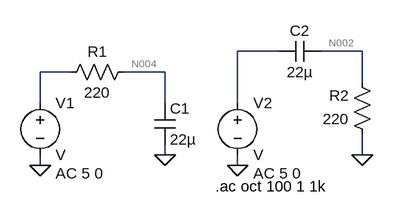
[diagram p0: schematic Draft2.asc]
Draft2.asc, the LTspice schematic file:
Version 4
SHEET 1 880 680
WIRE 336 96 272 96
WIRE 464 96 400 96
WIRE 16 128 -32 128
WIRE 160 128 96 128
WIRE 464 144 464 96
WIRE -32 176 -32 128
WIRE 160 176 160 128
WIRE 272 176 272 96
WIRE 160 256 160 240
WIRE 464 256 464 224
WIRE -32 272 -32 256
WIRE 272 272 272 256
FLAG 160 256 0
FLAG -32 272 0
FLAG 464 256 0
FLAG 272 272 0
SYMBOL res 112 112 R90
WINDOW 0 0 56 VBottom 2
WINDOW 3 32 56 VTop 2
SYMATTR InstName R1
SYMATTR Value 220
SYMBOL cap 144 176 R0
SYMATTR InstName C1
SYMATTR Value 22µ
SYMBOL voltage -32 160 R0
WINDOW 123 24 124 Left 2
WINDOW 39 0 0 Left 2
SYMATTR InstName V1
SYMATTR Value2 AC 5 0
SYMATTR SpiceLine ""
SYMBOL res 480 240 R180
WINDOW 0 36 76 Left 2
WINDOW 3 36 40 Left 2
SYMATTR InstName R2
SYMATTR Value 220
SYMBOL cap 336 112 R270
WINDOW 0 32 32 VTop 2
WINDOW 3 0 32 VBottom 2
SYMATTR InstName C2
SYMATTR Value 22µ
SYMBOL voltage 272 160 R0
WINDOW 123 24 124 Left 2
WINDOW 39 0 0 Left 2
SYMATTR InstName V2
SYMATTR Value2 AC 5 0
SYMATTR SpiceLine ""
TEXT 238 304 Left 2 !.ac oct 100 1 1k

The netlist it stands for:
* Draft2.asc
R1 N004 N003 220
C1 N004 0 22µ
V1 N003 0 V AC 5 0
R2 0 N002 220
C2 N001 N002 22µ
V2 N001 0 V AC 5 0
.ac oct 100 1 1k
.backanno
.end

* Results of the author's LTspice run, read from the files saved beside the schematic
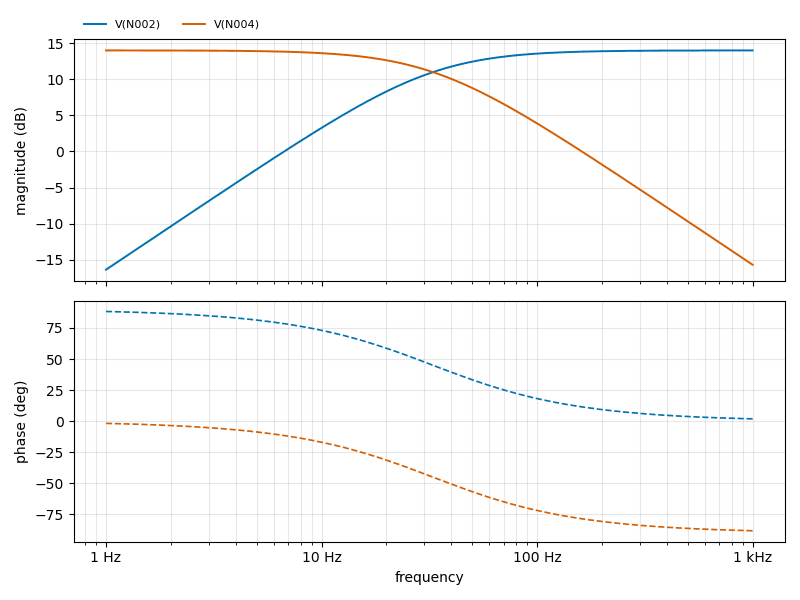
[diagram p1: AC Analysis of Draft2.asc, plotted from the saved traces]
* AC Analysis, 1 run:
*   V(N002): -16.36 dB at 1 Hz, 13.97 dB at 1 kHz, peak 13.97 dB at 1 kHz, 3 dB below the peak at 32.85 Hz
*   V(N004): 13.98 dB at 1 Hz, -15.69 dB at 1 kHz, peak 13.98 dB at 1 Hz, 3 dB below the peak at 32.91 Hz